# EAGLE design SCIR RPi COM (EAGLE 9.0.1)
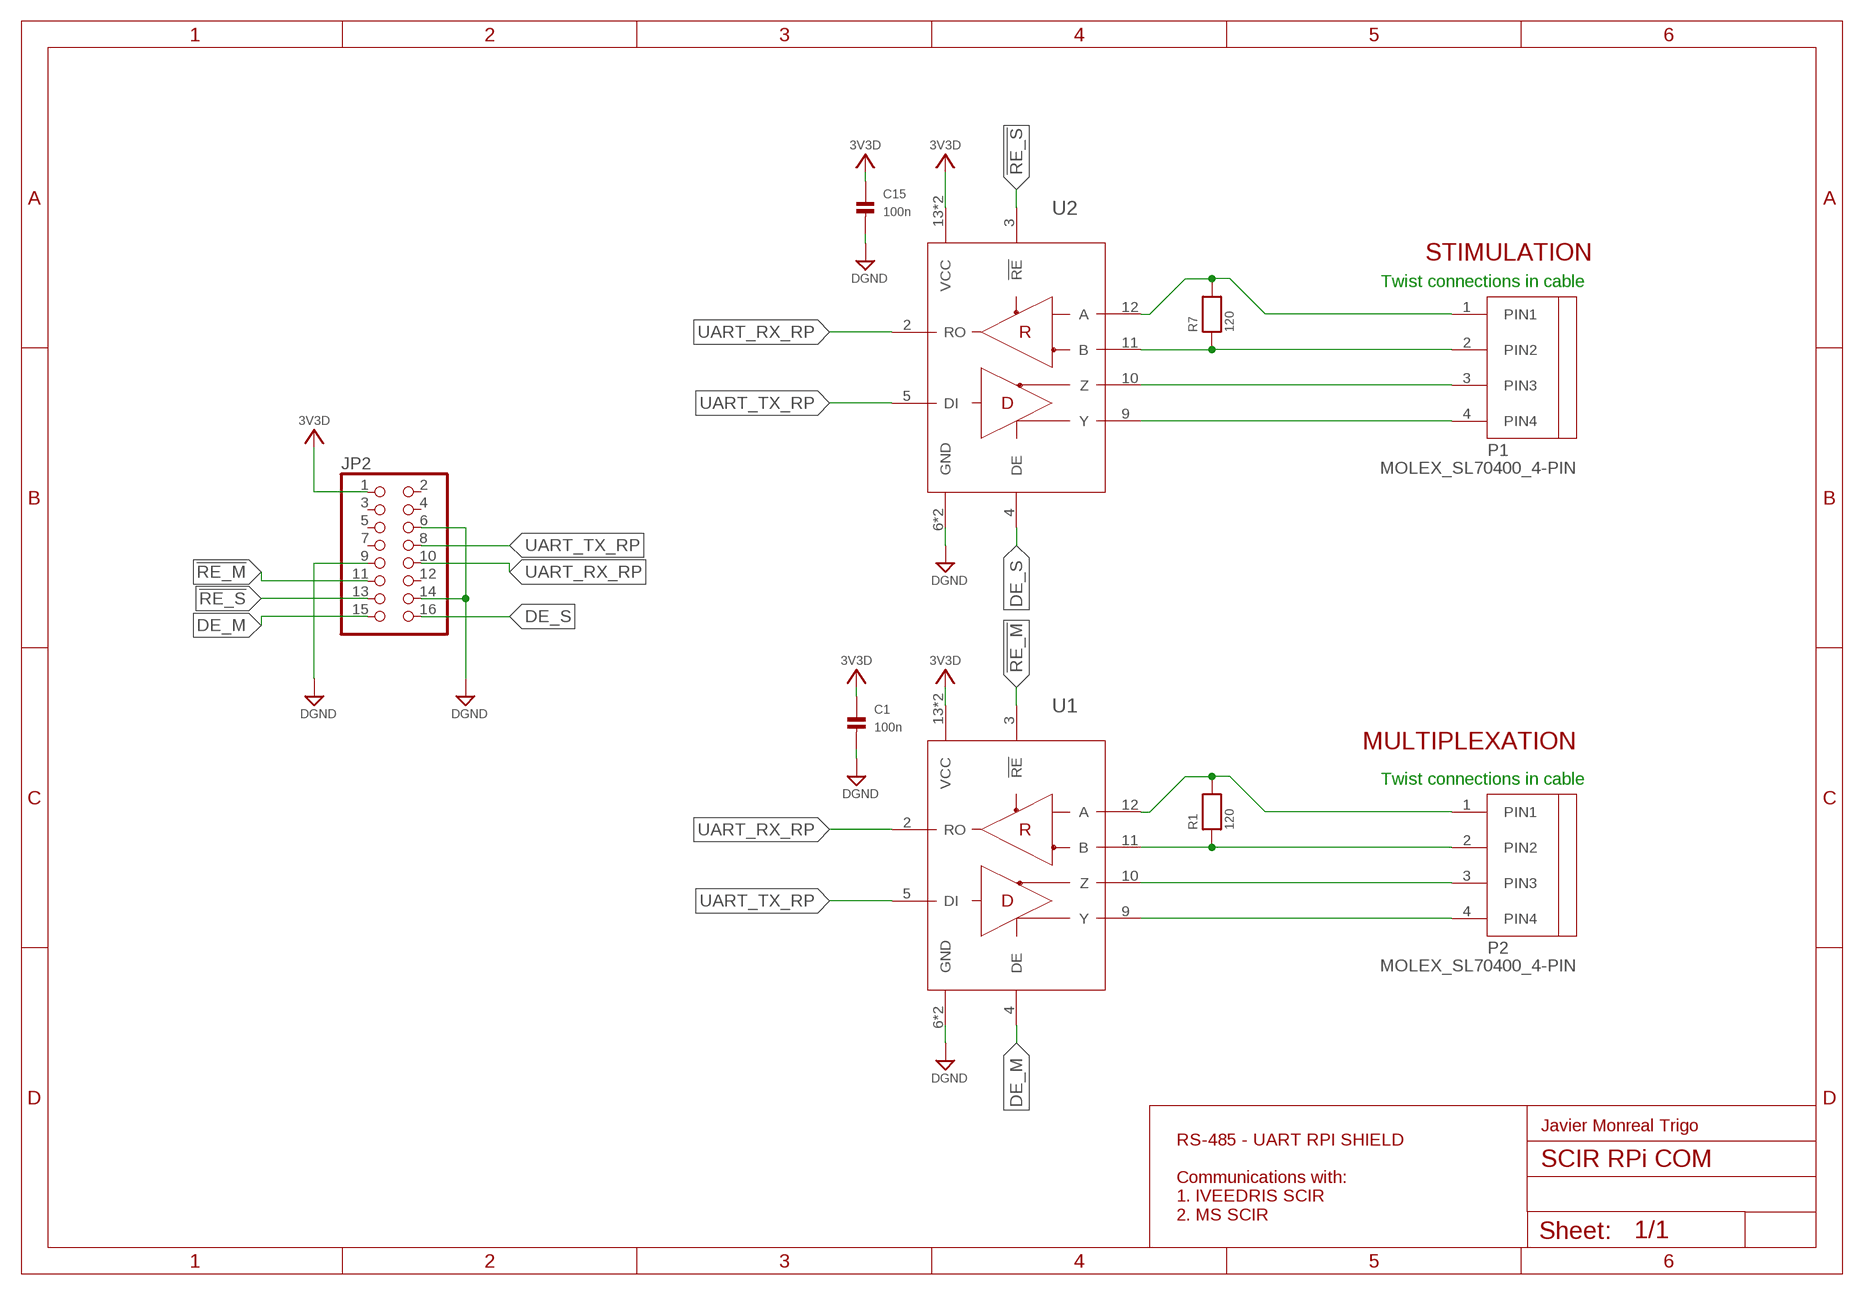
[diagram p0: schematic, sheet 1]

## Parts
C1  100n  CAP_CERAMIC0805  [0805]
C15  100n  CAP_CERAMIC0805  [0805]
JP2  HEADER-2X8  [2X08]
P1  MOLEX_SL70400_4-PIN  [MOLEX_SL70400_4-PIN]
P2  MOLEX_SL70400_4-PIN  [MOLEX_SL70400_4-PIN]
R1  120  RESISTOR0805  [0805]
R7  120  RESISTOR0805  [0805]
U1  MAX3491ECSD+  [SO14]
U2  MAX3491ECSD+  [SO14]

## Nets
3V3D: C1.1 C15.1 JP2.1 U1.13(VCC) U1.14(VCC) U2.13(VCC) U2.14(VCC)
!RE_M: JP2.11 U1.3(!RE)
!RE_S: JP2.13 U2.3(!RE)
DE_M: JP2.15 U1.4(DE)
DE_S: JP2.16 U2.4(DE)
DGND: C1.2 C15.2 JP2.6 JP2.9 JP2.14 U1.6(GND) U1.7(GND) U2.6(GND) U2.7(GND)
N$1: P1.1(PIN1) R7.2 U2.12(A)
N$2: P2.2(PIN2) R1.1 U1.11(B)
N$3: P1.3(PIN3) U2.10(Z)
N$4: P2.1(PIN1) R1.2 U1.12(A)
N$5: P1.4(PIN4) U2.9(Y)
N$6: P2.4(PIN4) U1.9(Y)
N$7: P2.3(PIN3) U1.10(Z)
N$40: P1.2(PIN2) R7.1 U2.11(B)
UART_RX_RP: JP2.10 U1.2(RO) U2.2(RO)
UART_TX_RP: JP2.8 U1.5(DI) U2.5(DI)
Unconnected: JP2.2 JP2.3 JP2.4 JP2.5 JP2.7 JP2.12

## Notes on the sheet
- STIMULATION
- Twist connections in cable
- MULTIPLEXATION
- Twist connections in cable
- Javier Monreal Trigo
- RS-485 - UART RPI SHIELD
  
  Communications with:
  1. IVEEDRIS SCIR
  2. MS SCIR

## Library data of the parts
C1 C15 = microbuilder:CAP_CERAMIC: Ceramic Capacitors 0402 - 0402 Surface Mount Capacitors 16pF 50V 5% [Digikey: 445-4899-2-ND] 18pF 50V 5% [Digikey: 490-1281-2-ND] 22pF 50V 5% [Digikey: 490-1283-2-ND] 68pF 50V 5% [Digikey: 490-1289-2-ND] 0.1uF 10V 10% [Digikey: 490-1318-2-ND] 1.0uF 6.3V 10% [Digikey: 490-1320-2-ND] 0603 - 0603 Surface Mount Capacitors 16 pF 50V 5% [Digikey: 445-5051-2-ND] 22 pF 50V [Digikey: PCC220ACVTR-ND] 33 pF 50V 5% [Digikey: 490-1415-1-ND] 56pF 50V 5% [Digikey: 490-1421-1-ND] 220pF 50V 5% [Digikey: 445-1285-1-ND] 680 pF 50V 2200 pF 50V 5% C0G [Digikey: 445-1297-1-ND] 5600 pF 100V 5% X7R [Digikey: 478-3711-1-ND] 0.1 µF 25V 10% [Digikey: PCC2277TR-ND] 0.22 µF 16V 10% X7R [Digikey: 445-1318-1-ND] 1.0 µF 25V 10% [Digikey: 445-5146-2-ND] 0603 - RF Specific 3pF 250V +/-0.1pF RF [Digikey: 712-1347-1-ND] 18 pF 250V 5% [Digikey: 478-3505-1-ND or 712-1322-1-ND] 56 pF 250V 5% C0G RF [Digikey: 490-4867-1-ND] 68 pF 250V RF [Digikey: 490-4868-1-ND] 0805 - 0805 Surface Mount Capacitors 220 pF 250V 2% RF Ceramic Capacitor [Digikey: 712-1398-1-ND] 1000 pF 50V 2% NP0 Ceramic Capacitor [Digikey: 478-3760-1-ND] 0.1 µF 25V 10% Ceramic Capacitor [Digikey: PCC1828TR-ND] 1.0 µF 16V 10% Ceramic Capacitor[Digikey: 490-1691-2-ND] 10.0 µF 10V 10% Ceramic Capacitor[Digikey: 709-1228-1-ND] 10.0 uF 16V 10% Ceramic Capacitor [Digikey: 478-5165-2-ND] 47 uF 6.3V 20% Ceramic Capacitor [Digikey: 587-1779-1-ND or 399-5506-1-ND] 1206 - 1206 Surface Mount Capacitors 47uF 10V 20% Ceramic Capacitor [Digikey: 490-5528-1-ND or 399-5508-1-ND or 445-6010-1-ND] 100uF 6.3V -20%, +80% Y5V Ceramic Capacitor (Digikey: 490-4512-1-ND, Mouser: 81-GRM31CF50J107ZE1L)
JP2 = microbuilder:HEADER-2X8
P1 P2 = IVEEDRIS-SCIR:MOLEX_SL70400_4-PIN; DIGIKEY_PRICE-STOCK: https://www.digikey.es/product-detail/es/molex/0705530038/WM4926-ND/313765; MANUFACTURER_NAME: Molex; MANUFACTURER_PART_NUMBER: 0705530038; SUPPLIER_PART_NUMBER: WM4926-ND
R1 R7 = microbuilder:RESISTOR: Resistors 0402 - 0402 Surface Mount Package 22 Ohm 1% 1/16W [Digikey: 311-22.0LRTR-ND] 33 Ohm 5% 1/16W 1.0K 5% 1/16W 1.5K 5% 1/16W 2.0K 1% 1/16W 10.0K 1% 1/16W [Digikey: 311-10.0KLRTR-ND] 10.0K 5% 1/16W [Digikey: RMCF0402JT10K0TR-ND] 12.1K 1% 1/16W [Digikey: 311-22.0LRTR-ND] 100.0K 5% 1/16W 0603 - 0603 Surface Mount Package 0 Ohm 1/10 Watt 1% Resistor 15 Ohm 1/10 Watt 1% Resistor 33 Ohm 1/10 Watt 1% Resistor 49.9 Ohm 1/10 Watt 1% Resistor 100 Ohm 1/10 Watt 1% Resistor 150 Ohm 1/10 Watt 1% Resistor 240 Ohm 1/10 Watt 1% Resistor 390 Ohm 1/10 Watt 1% Resistor 560 Ohm 1/10 Watt 1% Resistor 680 Ohm 1/10 Watt 1% Resistor 750 Ohm 1/10 Watt 1% Resistor 1.0K Ohm 1/10 Watt 1% Resistor 1.5K Ohm 1/10 Watt 1% Resistor 2.0K Ohm 1/10 Watt 1% Resistor 2.2K Ohm 1/10 Watt 1% Resistor 3.3K Ohm 1/10 Watt 1% Resistor 4.7K Ohm 1/10 Watt 1% Resistor 10.0K Ohm 1/10 Watt 1% Resistor 12.0K Ohm 1/10 Watt 1% Resistor 12.1K Ohm 1/10 Watt 1% Resistor 20.0K Ohm 1/10 Watt 1% Resistor 33.0K Ohm 1/10 Watt 1% Resistor 100.0K Ohm 1/10 Watt 1% Resistor 0805 - 0805 Surface Mount Package 0 Ohm 1/8 Watt 1% Resistor 33 Ohm 1/8 Watt 1% Resistor 100 Ohm 1/8 Watt 1% Resistor 150 Ohm 1/8 Watt 1% Resistor 200 Ohm 1/8 Watt 1% Resistor 240 Ohm 1/8 Watt 1% Resistor 330 Ohm 1/8 Watt 1% Resistor 390 Ohm 1/8 Watt 1% Resistor 470 Ohm 1/8 Watt 1% Resistor 1.0K Ohm 1/8 Watt 1% Resistor 1.5K Ohm 1/8 Watt 1% Resistor 2.0K Ohm 1/8 Watt 1% Resistor 4.7K Ohm 1/8 Watt 1% Resistor 5.1K Ohm 1/8 Watt 1% Resistor 5.6K Ohm 1/8 Watt 1% Resistor 10.0K Ohm 1/8 Watt 1% Resistor 22.0K Ohm 1/8 Watt 1% Resistor 33.0K Ohm 1/8 Watt 1% Resistor 100K Ohm 1/8 Watt 1% Resistor 1206 - 1206 Surface Mount Package 2012 - 2010 Surface Mount Package 0.11 Ohm 1/2 Watt 1% Resistor - Digikey: RHM.11UCT-ND
U1 U2 = IVEEDRIS-SCIR:MAX3491ECSD+

## Board
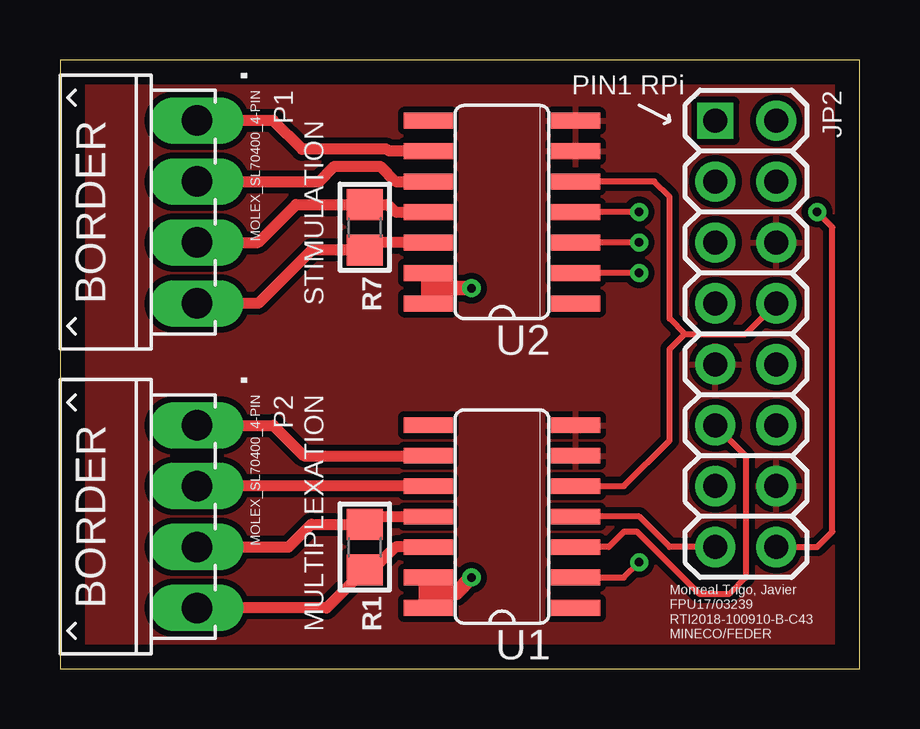
[diagram p1: board, top side]
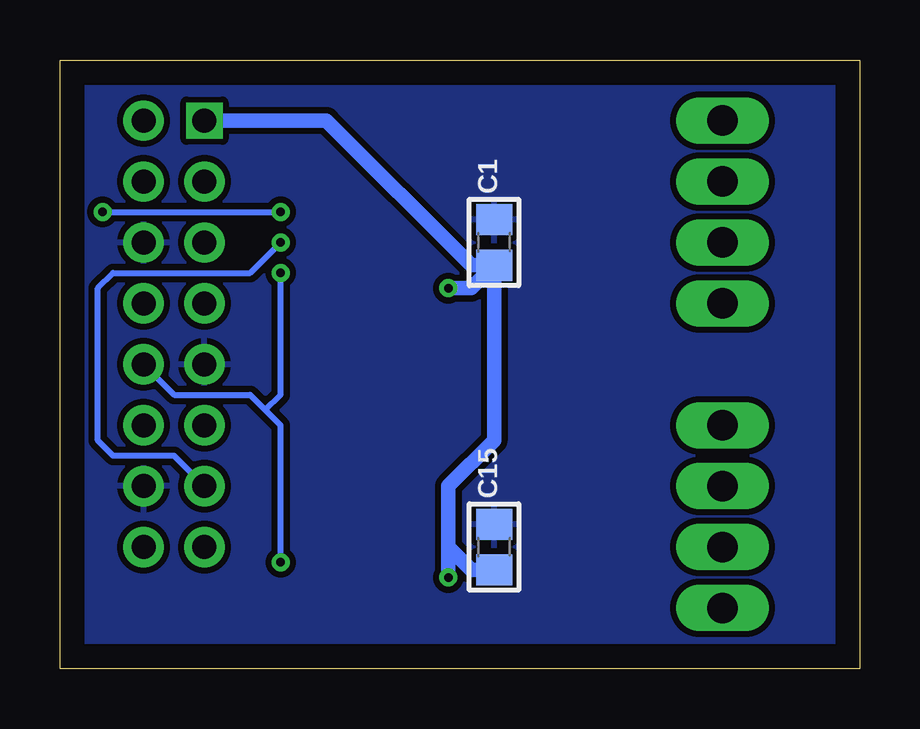
[diagram p2: board, bottom side, seen from below]

Size 33.33 x 25.39 mm. Coordinates in mm from the lower left corner, seen from the top.
Outline: 0,0 33.33,0 33.33,25.39 0,25.39 0,0
Copper layers (1*16): Top 0.035mm / dielectric 1.5mm / Bottom 0.035mm
Design rules "default *": minimum track width 6mil, minimum drill 0.35mm, track to track 10mil, track to pad 10mil, pad to pad 10mil, via to via 10mil, smd to smd 6mil, copper to edge 40mil, drill to drill 6mil, minimum pad ring 10mil, minimum via ring 8mil, stop-mask expansion 4mil, vias tented up to drill 0mil, thermal gap 10mil

### Footprints (pad centres in the part's own frame; a part is rotated, then mirrored left to right if it is on the bottom)
0805 = smd 1.3 x 1.5: 1 -0.95,0; 2 0.95,0
2X08 = drill 1 square: 1 -8.89,-1.27 | drill 1 pad 1.676: 2 -8.89,1.27; 3 -6.35,-1.27; 4 -6.35,1.27; 5 -3.81,-1.27; 6 -3.81,1.27; 7 -1.27,-1.27; 8 -1.27,1.27; 9 1.27,-1.27; 10 1.27,1.27; 11 3.81,-1.27; 12 3.81,1.27; 13 6.35,-1.27; 14 6.35,1.27; 15 8.89,-1.27; 16 8.89,1.27
MOLEX_SL70400_4-PIN = drill 1.27 pad 1.93 long: 1 3.81,0; 2 1.27,0; 3 -1.27,0; 4 -3.81,0
SO14 = smd 0.66 x 2.032: 1 -3.81,-3.073; 2 -2.54,-3.073; 3 -1.27,-3.073; 4 0,-3.073; 5 1.27,-3.073; 6 2.54,-3.073; 7 3.81,-3.073; 8 3.81,3.073; 9 2.54,3.073; 10 1.27,3.073; 11 0,3.073; 12 -1.27,3.073; 13 -2.54,3.073; 14 -3.81,3.073

### Placement (x,y rotation side)
C1  15.24,17.78 90 bottom
C15  15.24,5.08 90 bottom
JP2  28.57,13.97 270 top
P1  5.71,19.05 270 top
P2  5.71,6.35 270 top
R1  12.7,5.08 270 top
R7  12.7,18.41 270 top
U1  18.41,6.35 90 top
U2  18.41,19.05 90 top

### Tracks (layer width: path | path; a pad name or v marks a point on that pad's centre or on a via)
3V3D  (via drill 0.35)
  Top 0.61: U2.13 15.34,15.88 | 15.34,15.88 U2.14 | 15.34,15.88 v17.14,15.88 | v17.14,3.81 16.51,3.17 15.24,3.17 | 15.24,3.17 15.24,3.71 U1.13 | 15.24,3.17 15.24,2.64 U1.14
  Bottom 0.61: v17.14,15.88 16.2,15.88 C1.1 | C1.1 16.2,16.83 22.23,22.86 JP2.1 | C1.1 15.24,9.53 17.14,7.62 17.14,5.08 | 17.14,5.08 16.2,4.13 C15.1 | 17.14,5.08 v17.14,3.81
!RE_M
  Top 0.254: U1.3 22.86,5.08 23.5,5.71 24.05,5.71 26.63,3.13 27.9,3.13 28.57,3.81 28.57,8.89 JP2.11
!RE_S  (via drill 0.35)
  Top 0.254: v24.13,17.78 U2.3
  Bottom 0.254: v24.13,17.78 25.4,16.51 31.11,16.51 31.75,15.88 31.75,9.53 31.11,8.89 28.57,8.89 JP2.13
DE_M
  Top 0.254: U1.4 24.13,6.35 25.4,5.08 JP2.15
DE_S  (via drill 0.35)
  Top 0.254: v31.55,19.05 32.18,18.41 32.18,5.71 31.55,5.08 JP2.16 | v24.13,19.05 U2.4
  Bottom 0.254: v31.55,19.05 v24.13,19.05
DGND
  pour Top: 0,25.4 33.66,25.4 33.66,0 0,0
  pour Bottom: 0,25.4 33.66,25.4 33.66,0 0,0
N$1
  Top 0.457: U2.12 13.02,17.78 R7.2 10.48,17.46 8.26,15.24 P1.1
N$2
  Top 0.457: P2.2 9.53,5.08 10.47,6.03 R1.1 13.02,6.35 U1.11
N$3
  Top 0.457: U2.10 13.97,20.32 13.34,20.95 11.43,20.95 10.79,20.32 P1.3
N$4
  Top 0.457: U1.12 13.97,5.08 13.02,4.13 R1.2 11.11,2.54 P2.1
N$5
  Top 0.457: U2.9 13.71,21.59 13.63,21.67 10.08,21.67 8.89,22.86 P1.4
N$6
  Top 0.457: P2.4 8.89,10.16 10.16,8.89 U1.9
N$7
  Top 0.457: U1.10 P2.3
N$40
  Top 0.457: P1.2 8.26,17.78 9.84,19.36 R7.1 13.65,19.36 13.97,19.05 U2.11 15.88,19.05
UART_RX_RP  (via drill 0.35)
  Top 0.254: v24.13,16.51 U2.2 | U1.2 23.5,3.81 v24.13,4.45
  Bottom 0.254: v24.13,16.51 24.13,11.43 24.77,10.79 | v24.13,4.45 24.13,10.16 24.77,10.79 | JP2.10 28.57,11.43 25.4,11.43 24.77,10.79
UART_TX_RP
  Top 0.254: U1.5 23.5,7.62 25.4,9.53 25.4,13.34 26.04,13.97 | 26.04,13.97 28.57,13.97 JP2.8 | 26.04,13.97 25.4,14.61 25.4,19.68 24.77,20.32 U2.5

### Text on the board
tPlace: PIN1 RPi | STIMULATION | MULTIPLEXATION | Monreal Trigo, Javier / FPU17/03239 / RTI2018-100910-B-C43 / MINECO/FEDER